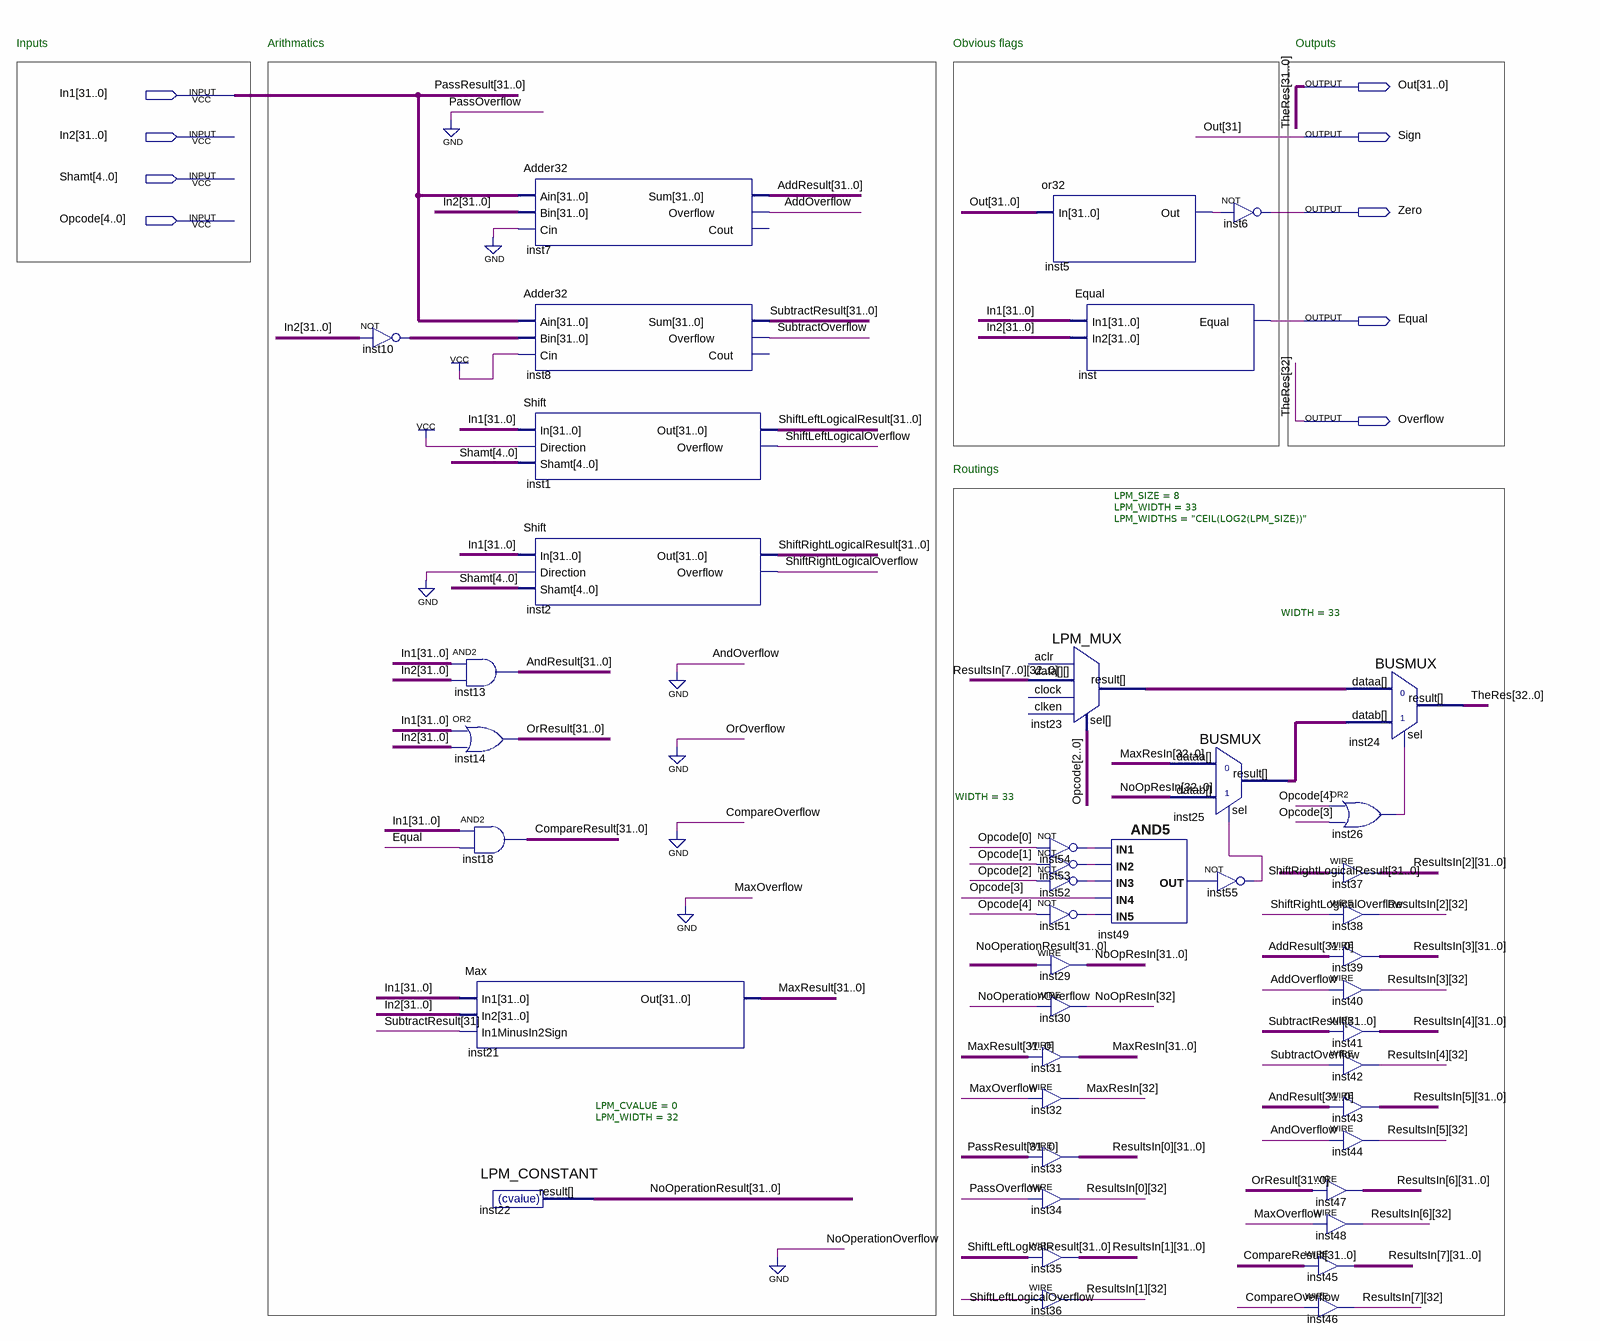
[diagram p0: schematic sheet]
// Quartus schematic ALU.bdf as structural Verilog: 43 symbols, 9 pins
module ALU (
  input  [31:0] In1,
  input  [31:0] In2,
  input  [4:0] Shamt,
  input  [4:0] Opcode,
  output [31:0] Out,
  output Sign,
  output Zero,
  output Equal,
  output Overflow
);

  wire AddOverflow, inst5_out, inst26_out, inst49_out, inst51_out, inst52_out, inst53_out, inst54_out,
       inst55_out, ShiftLeftLogicalOverflow, ShiftRightLogicalOverflow, SubtractOverflow;
  wire [31:0] AddResult, AndResult, CompareResult, inst10_out, MaxResult, NoOperationResult, OrResult,
       PassResult, ShiftLeftLogicalResult, ShiftRightLogicalResult, SubtractResult, TheRes;
  wire [32:0] inst23_result, inst25_result, MaxResIn, NoOpResIn, ResultsIn_0, ResultsIn_1, ResultsIn_2,
       ResultsIn_3, ResultsIn_4, ResultsIn_5, ResultsIn_6, ResultsIn_7;

  assign inst10_out = ~In2;  // NOT inst10, 32 bits wide
  assign AndResult = In1 & In2;  // AND2 inst13, 32 bits wide
  assign OrResult = In1 | In2;  // OR2 inst14, 32 bits wide
  assign CompareResult = In1 & {32{Equal}};  // AND2 inst18, 32 bits wide
  Max inst21 (.In1(In1), .In2(In2), .In1MinusIn2Sign(SubtractResult[31]), .Out(MaxResult));
  LPM_CONSTANT #(.LPM_CVALUE(0), .LPM_WIDTH(32)) inst22 (.result(NoOperationResult));
  Adder32 inst7 (.Ain(PassResult), .Bin(In2), .Cin(1'b0), .Sum(AddResult), .Overflow(AddOverflow));  // open: Cout
  Adder32 inst8 (
    .Ain(PassResult), .Bin(inst10_out), .Cin(1'b1), .Sum(SubtractResult), .Overflow(SubtractOverflow));  // open: Cout
  Shift inst1 (
    .In(In1), .Direction(1'b1), .Shamt(Shamt), .Out(ShiftLeftLogicalResult),
    .Overflow(ShiftLeftLogicalOverflow));
  Shift inst2 (
    .In(In1), .Direction(1'b0), .Shamt(Shamt), .Out(ShiftRightLogicalResult),
    .Overflow(ShiftRightLogicalOverflow));
  or32 inst5 (.In(Out), .Out(inst5_out));
  LPM_MUX #(.LPM_SIZE(8), .LPM_WIDTH(33), .LPM_WIDTHS("CEIL(LOG2(LPM_SIZE))")) inst23 (
    .data({ResultsIn_7, ResultsIn_6, ResultsIn_5, ResultsIn_4, ResultsIn_3, ResultsIn_2, ResultsIn_1, ResultsIn_0}),
    .sel(Opcode[2:0]), .result(inst23_result));  // open: clock, aclr, clken
  not inst54 (inst54_out, Opcode[0]);
  not inst53 (inst53_out, Opcode[1]);
  not inst52 (inst52_out, Opcode[2]);
  not inst51 (inst51_out, Opcode[4]);
  assign NoOpResIn[31:0] = NoOperationResult;  // WIRE inst29
  assign NoOpResIn[32] = 1'b0;  // WIRE inst30
  assign MaxResIn[31:0] = MaxResult;  // WIRE inst31
  assign MaxResIn[32] = 1'b0;  // WIRE inst32
  assign ResultsIn_0[31:0] = PassResult;  // WIRE inst33
  assign ResultsIn_0[32] = 1'b0;  // WIRE inst34
  assign ResultsIn_1[31:0] = ShiftLeftLogicalResult;  // WIRE inst35
  assign ResultsIn_1[32] = ShiftLeftLogicalOverflow;  // WIRE inst36
  Equal inst (.In1(In1), .In2(In2), .Equal(Equal));
  and inst49 (inst49_out, inst54_out, inst53_out, inst52_out, Opcode[3], inst51_out);
  BUSMUX #(.WIDTH(33)) inst25 (.datab(NoOpResIn), .sel(inst55_out), .dataa(MaxResIn), .result(inst25_result));
  not inst6 (Zero, inst5_out);
  not inst55 (inst55_out, inst49_out);
  assign ResultsIn_6[31:0] = OrResult;  // WIRE inst47
  assign ResultsIn_6[32] = 1'b0;  // WIRE inst48
  assign ResultsIn_7[31:0] = CompareResult;  // WIRE inst45
  assign ResultsIn_7[32] = 1'b0;  // WIRE inst46
  BUSMUX #(.WIDTH(33)) inst24 (
    .datab(inst25_result), .sel(inst26_out), .dataa(inst23_result), .result({Overflow, TheRes}));
  or inst26 (inst26_out, Opcode[4], Opcode[3]);
  assign ResultsIn_2[31:0] = ShiftRightLogicalResult;  // WIRE inst37
  assign ResultsIn_2[32] = ShiftRightLogicalOverflow;  // WIRE inst38
  assign ResultsIn_3[31:0] = AddResult;  // WIRE inst39
  assign ResultsIn_3[32] = AddOverflow;  // WIRE inst40
  assign ResultsIn_4[31:0] = SubtractResult;  // WIRE inst41
  assign ResultsIn_4[32] = SubtractOverflow;  // WIRE inst42
  assign ResultsIn_5[31:0] = AndResult;  // WIRE inst43
  assign ResultsIn_5[32] = 1'b0;  // WIRE inst44

  assign Sign = Out[31];

  // Other names for the same wires on the sheet: TheRes[32] = Overflow

  // Notes on the sheet:
  //   Inputs
  //   Arithmatics
  //   Obvious flags
  //   Outputs
  //   Routings
endmodule
